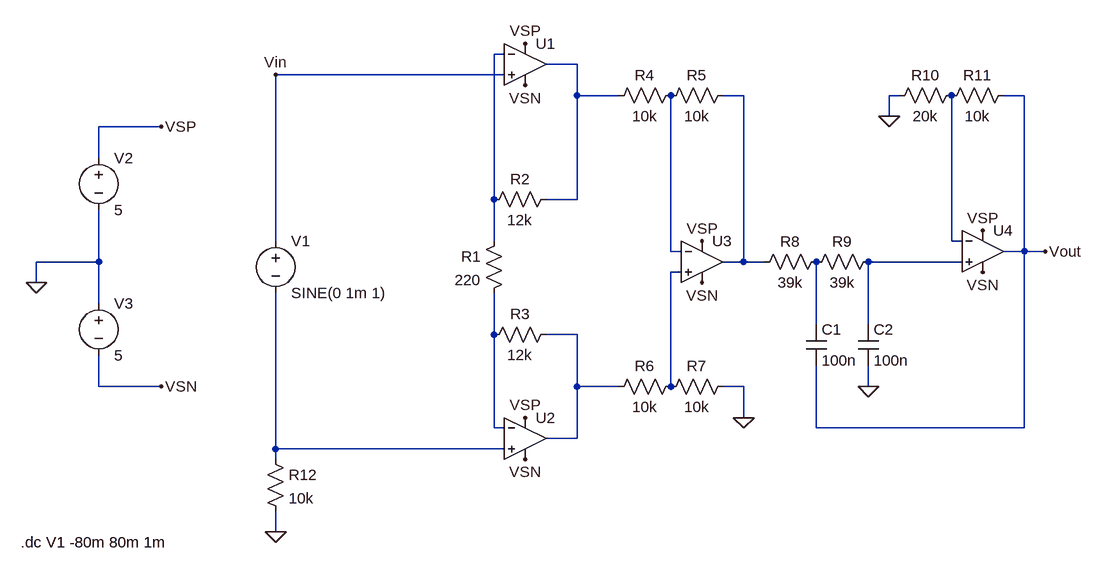
[diagram p0: schematic ex2.asc]
ex2.asc, the LTspice schematic file:
Version 4
SHEET 1 1896 680
WIRE 720 -128 704 -128
WIRE 832 -112 784 -112
WIRE 720 -96 368 -96
WIRE 832 -64 832 -112
WIRE 896 -64 832 -64
WIRE 1088 -64 1056 -64
WIRE 1328 -64 1312 -64
WIRE 1520 -64 1488 -64
WIRE 1312 -32 1312 -64
WIRE 192 -16 96 -16
WIRE 96 32 96 -16
WIRE 704 96 704 -128
WIRE 832 96 832 -64
WIRE 832 96 784 96
WIRE 368 160 368 -96
WIRE 704 160 704 96
WIRE 1408 160 1408 -64
WIRE 1424 160 1408 160
WIRE 976 176 976 -64
WIRE 992 176 976 176
WIRE 1520 176 1520 -64
WIRE 1520 176 1488 176
WIRE 1552 176 1520 176
WIRE 96 192 96 112
WIRE 96 192 0 192
WIRE 1088 192 1088 -64
WIRE 1088 192 1056 192
WIRE 1120 192 1088 192
WIRE 1424 192 1280 192
WIRE 992 208 976 208
WIRE 0 224 0 192
WIRE 96 256 96 192
WIRE 1200 288 1200 192
WIRE 1280 288 1280 192
WIRE 704 304 704 240
WIRE 832 304 784 304
WIRE 96 384 96 336
WIRE 192 384 96 384
WIRE 832 384 832 304
WIRE 896 384 832 384
WIRE 976 384 976 208
WIRE 1088 384 1056 384
WIRE 1280 384 1280 352
WIRE 1088 432 1088 384
WIRE 704 448 704 304
WIRE 720 448 704 448
WIRE 1200 448 1200 352
WIRE 1520 448 1520 176
WIRE 1520 448 1200 448
WIRE 832 464 832 384
WIRE 832 464 784 464
WIRE 368 480 368 240
WIRE 720 480 368 480
WIRE 368 496 368 480
WIRE 368 608 368 576
FLAG 0 224 0
FLAG 192 -16 VSP
FLAG 192 384 VSN
FLAG 1088 432 0
FLAG 1280 384 0
FLAG 1312 -32 0
FLAG 368 608 0
FLAG 752 -144 VSP
FLAG 752 432 VSP
FLAG 1024 160 VSP
FLAG 1456 144 VSP
FLAG 752 -80 VSN
FLAG 752 496 VSN
FLAG 1024 224 VSN
FLAG 1456 208 VSN
FLAG 1552 176 Vout
FLAG 368 -96 Vin
SYMBOL voltage 368 144 R0
WINDOW 123 0 0 Left 0
WINDOW 39 0 0 Left 0
SYMATTR InstName V1
SYMATTR Value SINE(0 1m 1)
SYMBOL voltage 96 16 R0
WINDOW 123 0 0 Left 0
WINDOW 39 0 0 Left 0
SYMATTR InstName V2
SYMATTR Value 5
SYMBOL voltage 96 240 R0
WINDOW 123 0 0 Left 0
WINDOW 39 0 0 Left 0
SYMATTR InstName V3
SYMATTR Value 5
SYMBOL res 720 144 M0
SYMATTR InstName R1
SYMATTR Value 220
SYMBOL res 800 80 R90
WINDOW 0 0 56 VBottom 2
WINDOW 3 32 56 VTop 2
SYMATTR InstName R2
SYMATTR Value 12k
SYMBOL res 800 288 R90
WINDOW 0 0 56 VBottom 2
WINDOW 3 32 56 VTop 2
SYMATTR InstName R3
SYMATTR Value 12k
SYMBOL OpAmps\\UniversalOpAmp2 752 -112 R0
SYMATTR InstName U1
SYMBOL OpAmps\\UniversalOpAmp2 752 464 R0
SYMATTR InstName U2
SYMBOL res 992 -80 R90
WINDOW 0 0 56 VBottom 2
WINDOW 3 32 56 VTop 2
SYMATTR InstName R4
SYMATTR Value 10k
SYMBOL res 1072 -80 R90
WINDOW 0 0 56 VBottom 2
WINDOW 3 32 56 VTop 2
SYMATTR InstName R5
SYMATTR Value 10k
SYMBOL res 992 368 R90
WINDOW 0 0 56 VBottom 2
WINDOW 3 32 56 VTop 2
SYMATTR InstName R6
SYMATTR Value 10k
SYMBOL res 1072 368 R90
WINDOW 0 0 56 VBottom 2
WINDOW 3 32 56 VTop 2
SYMATTR InstName R7
SYMATTR Value 10k
SYMBOL OpAmps\\UniversalOpAmp2 1024 192 R0
SYMATTR InstName U3
SYMBOL res 1216 176 R90
WINDOW 0 0 56 VBottom 2
WINDOW 3 32 56 VTop 2
SYMATTR InstName R8
SYMATTR Value 39k
SYMBOL res 1296 176 R90
WINDOW 0 0 56 VBottom 2
WINDOW 3 32 56 VTop 2
SYMATTR InstName R9
SYMATTR Value 39k
SYMBOL cap 1184 288 R0
SYMATTR InstName C1
SYMATTR Value 100n
SYMBOL cap 1264 288 R0
SYMATTR InstName C2
SYMATTR Value 100n
SYMBOL OpAmps\\UniversalOpAmp2 1456 176 R0
SYMATTR InstName U4
SYMBOL res 1424 -80 R90
WINDOW 0 0 56 VBottom 2
WINDOW 3 32 56 VTop 2
SYMATTR InstName R10
SYMATTR Value 20k
SYMBOL res 1504 -80 R90
WINDOW 0 0 56 VBottom 2
WINDOW 3 32 56 VTop 2
SYMATTR InstName R11
SYMATTR Value 10k
SYMBOL res 352 480 R0
SYMATTR InstName R12
SYMATTR Value 10k
TEXT -24 624 Left 2 !.dc V1 -80m 80m 1m

The netlist it stands for:
* ex2.asc
V1 Vin N011 SINE(0 1m 1)
V2 VSP 0 5
V3 0 VSN 5
R1 N001 N009 220
R2 N002 N001 12k
R3 N010 N009 12k
XU1 Vin N001 VSP VSN N002 level2 Avol=1Meg GBW=10Meg Slew=10Meg Ilimit=25m Rail=0 Vos=0 En=0 Enk=0 In=0 Ink=0 Rin=500Meg  ; pins In+ In- V+ V- OUT
XU2 N011 N009 VSP VSN N010 level2 Avol=1Meg GBW=10Meg Slew=10Meg Ilimit=25m Rail=0 Vos=0 En=0 Enk=0 In=0 Ink=0 Rin=500Meg  ; pins In+ In- V+ V- OUT
R4 N005 N002 10k
R5 N003 N005 10k
R6 N007 N010 10k
R7 0 N007 10k
XU3 N007 N005 VSP VSN N003 level2 Avol=1Meg GBW=10Meg Slew=10Meg Ilimit=25m Rail=0 Vos=0 En=0 Enk=0 In=0 Ink=0 Rin=500Meg  ; pins In+ In- V+ V- OUT
R8 N008 N003 39k
R9 N006 N008 39k
C1 N008 Vout 100n
C2 N006 0 100n
XU4 N006 N004 VSP VSN Vout level2 Avol=1Meg GBW=10Meg Slew=10Meg Ilimit=25m Rail=0 Vos=0 En=0 Enk=0 In=0 Ink=0 Rin=500Meg  ; pins In+ In- V+ V- OUT
R10 N004 0 20k
R11 Vout N004 10k
R12 N011 0 10k
.dc V1 -80m 80m 1m
.lib UniversalOpAmp2.lib
.backanno
.end